# Altium project SWDPort.PrjPcb
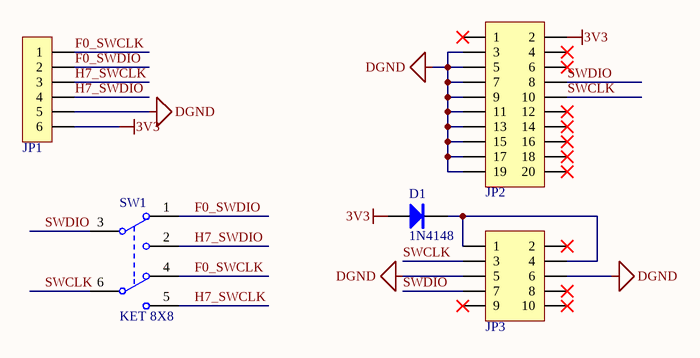
[diagram p0: SWDPort.SchDoc]
1 sheet, 5 parts. Net scope: global (net labels, ports and power ports of the same name join across sheets).
Board file: SWDPort.PcbDoc

## Sheet SWDPort.SchDoc
size A4; SheetNumber: 1; SheetTotal: 1

### Parts
D1  1N4148  [SOD-323]
JP1  HDR-1X6  [MX 1.25-WS-6P]  (value not drawn)
JP2  Header 2X10  [HDR2.54-LI-2x10P]  (value not drawn)
JP3  Header 5X2  [HDR2.54-LI-2x5P]  (value not drawn)
SW1  KET 8X8  [KFT DIP-8X8]

### Nets
3V3: D1.1(A) JP1.6 JP2.2
DGND: JP1.5 JP2.3 JP2.5 JP2.7 JP2.9 JP2.11 JP2.13 JP2.15 JP2.17 JP2.19 JP3.5 JP3.6
F0_SWCLK: JP1.1 SW1.4(NO2)
F0_SWDIO: JP1.2 SW1.1(NC1)
H7_SWCLK: JP1.3 SW1.5(COM2)
H7_SWDIO: JP1.4 SW1.2(COM2)
SWCLK: JP2.10 JP3.3 SW1.6(NC2)
SWDIO: JP2.8 JP3.7 SW1.3(NO1)
NetD1_2: D1.2(K) JP3.1 JP3.4

Not connected (* = marked no-connect by the designer): JP2 1* 4* 6* 12* 14* 16* 18* 20*; JP3 2* 8* 9* 10*

### Library data of the parts
D1 = 1N4148: 开关二极管; BOM名称: 高速开关二极管; 卖家免费技术支持，联系售后: 唯一出售店铺网址https://shop463601444.taobao.com; 优秀评价可免费更新: 联系淘宝ID：黄晶宝石，获取更新版封装库; 封装库 来自淘宝卖家 ID：黄晶宝石: 其他店铺购入均为盗版，请立即申请退款
JP1 = Header 6: 6P接插件; 版权归属: 源创客; BOM名称: 6P接插件; 学习资源: www.ooocke.com
JP2 = Header 10X2: 10*2P接插件; 版权归属: 源创客; BOM名称: 10*2P接插件; 学习资源: www.ooocke.com
JP3 = Header 5X2: 5*2P接插件; 版权归属: 源创客; BOM名称: 5*2P接插件; 学习资源: www.ooocke.com
SW1 = KET 8X8: 8*8自锁开关; 版权归属: 源创客; BOM名称: 8*8自锁开关; 学习资源: www.ooocke.com